# Altium schematic sheet GYRO-ACCELEROMETER.SchDoc
size A4
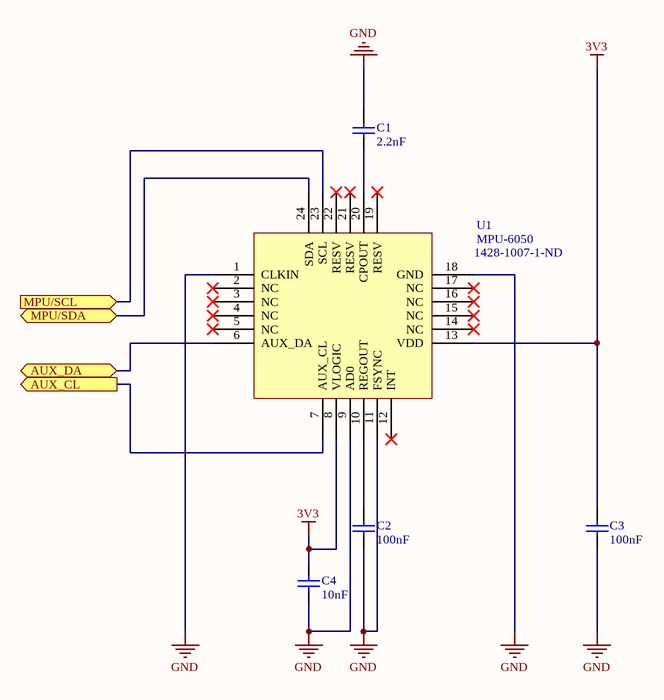
[diagram p0: GYRO-ACCELEROMETER.SchDoc]

## Parts
C1  2.2nF  [C0603(1608)]
C2  100nF  [C0603(1608)]
C3  100nF  [C0603(1608)]
C4  10nF  [C0603(1608)]
U1  MPU-6050  Supplier Part Number 1: 1428-1007-1-ND  [LGA 24]

## Ports
AUX_CL (out), AUX_DA (bidir), MPU/SCL (in), MPU/SDA (bidir)

## Nets
3V3: C3.2 C4.2 U1.8(VLOGIC) U1.13(VDD)
GND: C1.1 C2.1 C3.1 C4.1 U1.1(CLKIN) U1.9(AD0) U1.11(FSYNC) U1.18(GND)
AUX_CL: U1.7(AUX_CL) ; port AUX_CL
AUX_DA: U1.6(AUX_DA) ; port AUX_DA
MPU/SCL: U1.23(SCL) ; port MPU/SCL
MPU/SDA: U1.24(SDA) ; port MPU/SDA
NetC1_2: C1.2 U1.20(CPOUT)
NetC2_2: C2.2 U1.10(REGOUT)

Not connected (* = marked no-connect by the designer): U1 2(NC)* 3(NC)* 4(NC)* 5(NC)* 12(INT)* 14(NC)* 15(NC)* 16(NC)* 17(NC)* 19(RESV)* 21(RESV)* 22(RESV)*

## Library data of the parts
C1-C4 = Cap: Capacitor
U1 = MPU-9150: IMU ACCEL/GYRO 3-AXIS I2C 24QFN; Manufacturer: TDK InvenSense; Description: INVENSENSE - MPU-6050 - GYRO / ACCEL, 6-AXIS, I2C, QFN-24; Min Supply Voltage: 2.5V; Max Supply Voltage: 3.6V; Output Type: Digital; Sensitivity: 16384LSB/g; Supplier 1: Digi-Key; Manufacturer Part Number: MPU-6050; RoHS: Yes; Stock 1: 12300; Pricing 1: 1 = 8.310000, 5 = 7.288000, 10 = 6.559000, 25 = 5.830000, 50 = 5.392800, 100 = 4.664000, 500 = 4.372500, 1000 = 4.081000 (USD); Mount: Surface Mount; Case/Package: QFN; Number of Pins: 24; Min Operating Temperature: -40°C; Max Operating Temperature: 85°C; Package Quantity: 5000; Interface: I2C; Packaging: Cut Tape; Length: 4.1mm; Height: 0.9mm; Width: 4.1mm; REACH SVHC: No SVHC; ComponentLink1URL: http://www.farnell.com/datasheets/1788002.pdf?src-supplier=Element14; ComponentLink1Description: http://www.farnell.com/datasheets/1788002.pdf?src-supplier=Element14